# EAGLE schematic pathfiner (EAGLE 9.1.2)
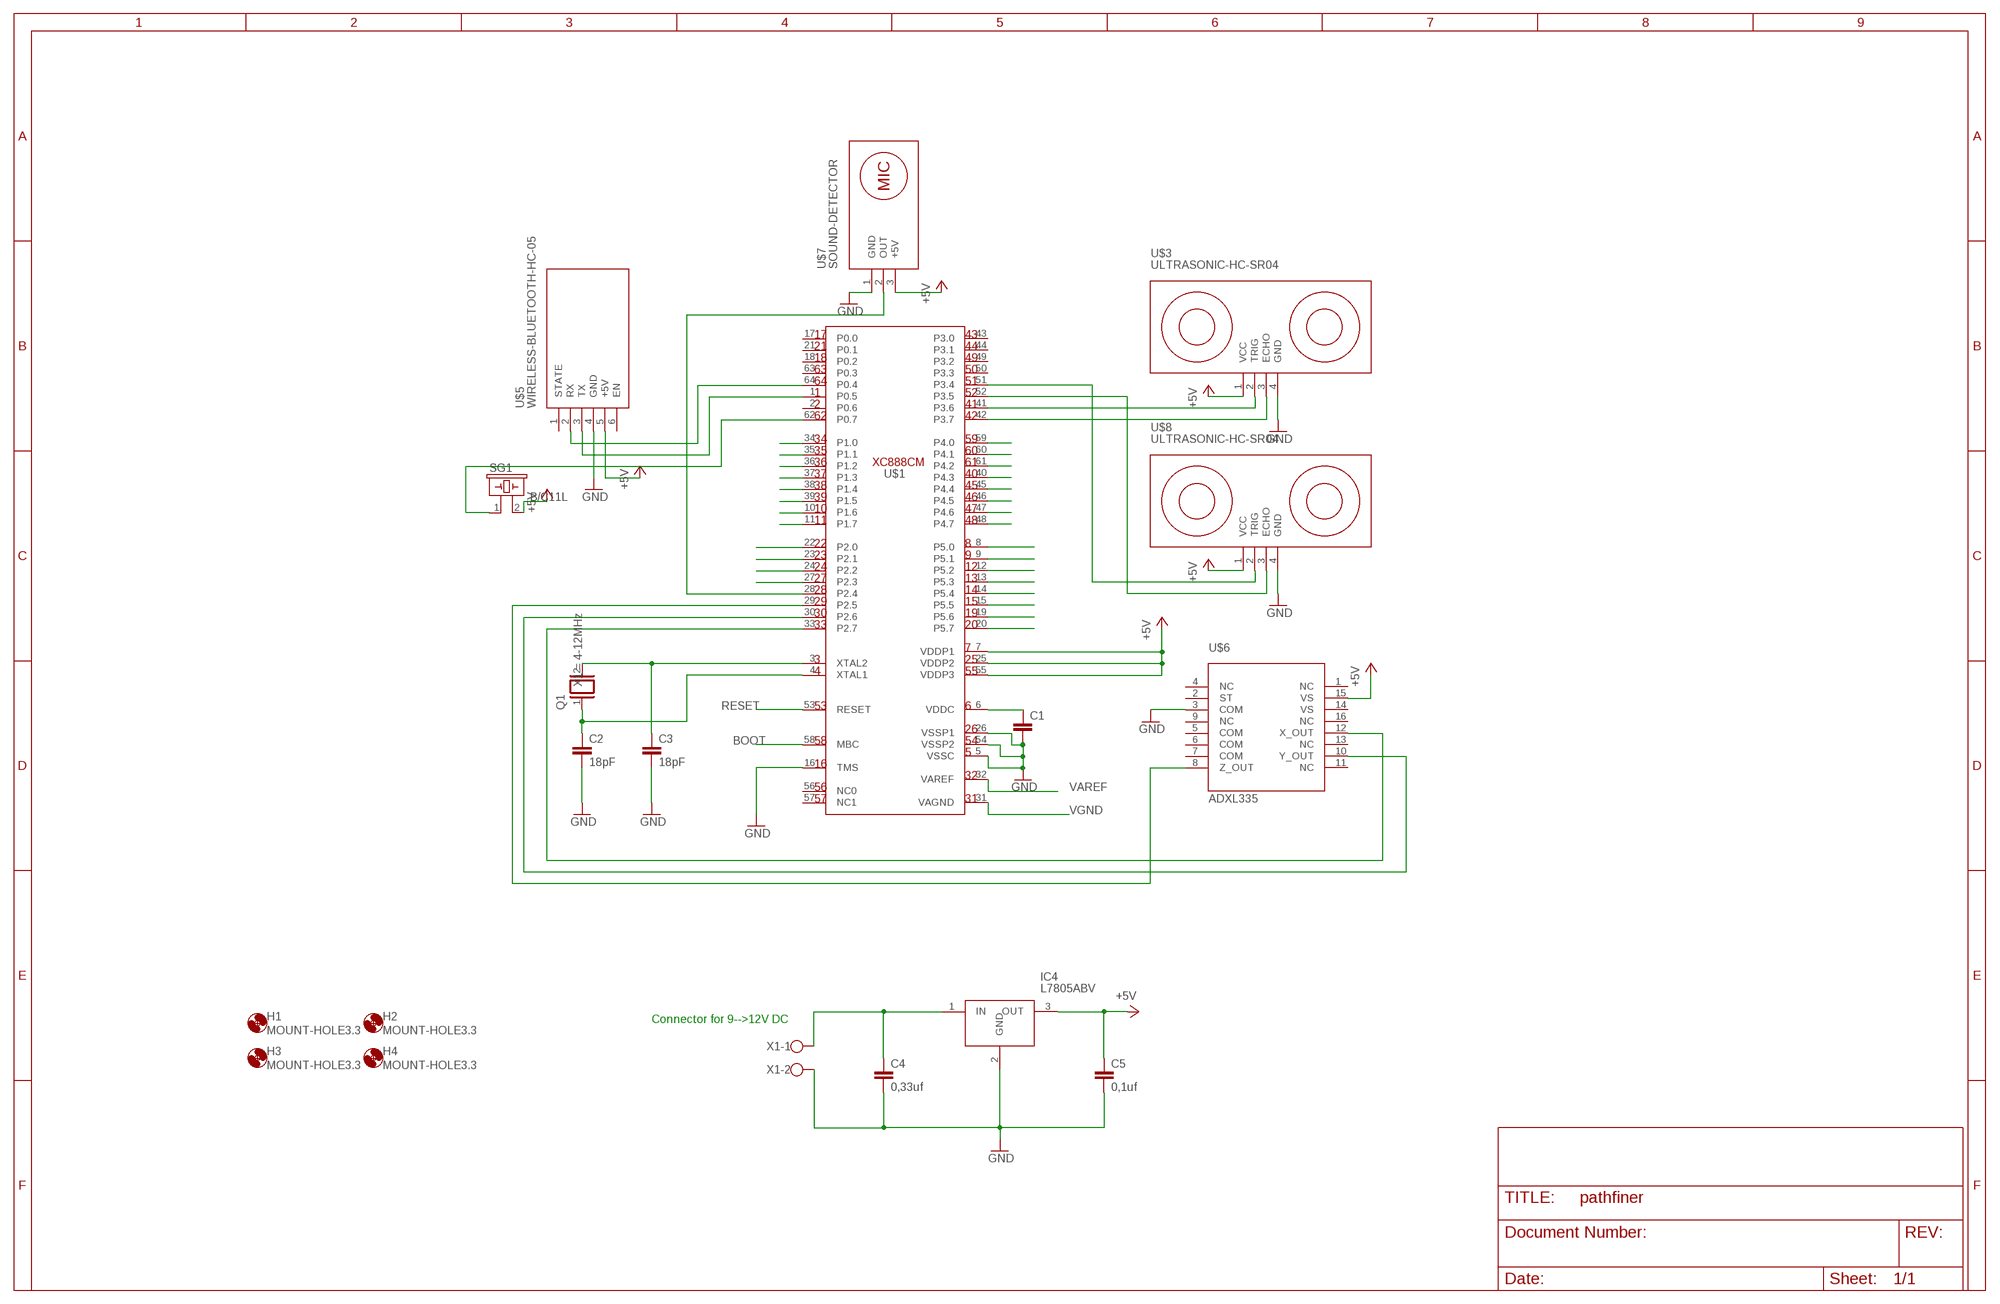
[diagram p0: schematic, sheet 1]

## Parts
C1  C2,5-3  [C2.5-3]
C2  18pF  C2,5-3  [C2.5-3]
C3  18pF  C2,5-3  [C2.5-3]
C4  0,33uf  C-EU025-030X050  [C025-030X050]
C5  0,1uf  C-EU025-030X050  [C025-030X050]
H1  MOUNT-HOLE3.3  [3,3]
H2  MOUNT-HOLE3.3  [3,3]
H3  MOUNT-HOLE3.3  [3,3]
H4  MOUNT-HOLE3.3  [3,3]
IC4  L7805ABV  [TO270P460X1020X2008-3P]
Q1  XTAL  [Q]
SG1  B/C11L  [B/C11L]
U$1  XC888  [QFP50P1200X1200X160-64N]
U$3  ULTRASONIC-HC-SR04  [ULTRASONIC-HC-SR04]
U$5  WIRELESS-BLUETOOTH-HC-05  [WIRELESS-BLUETOOTH-HC-05]
U$6  ADXL335  [LFCSP16]
U$7  SOUND-DETECTOR  [SOUND-DETECTOR]
U$8  ULTRASONIC-HC-SR04  [ULTRASONIC-HC-SR04]
X1  W237-102  [W237-102]

## Nets
+5V: C5.1 IC4.3(OUT) SG1.2 U$1.7(VDDP1) U$1.25(VDDP2) U$1.55(VDDP3) U$3.1(VCC) U$5.5(+5V) U$6.15(VS) U$7.3(+5V) U$8.1(VCC)
BOOT: U$1.58(MBC)
GND: C1.2 C2.2 C3.2 C4.2 C5.2 IC4.2(GND) U$1.5(VSSC) U$1.16(TMS) U$1.26(VSSP1) U$1.54(VSSP2) U$3.4(GND) U$5.4(GND) U$6.3(COM) U$7.1(GND) U$8.4(GND) X1.2
N$1: U$1.33(P2.7) U$6.12(X_OUT)
N$2: U$1.28(P2.4) U$7.2(OUT)
N$3: U$1.29(P2.5) U$6.8(Z_OUT)
N$4: C4.1 IC4.1(IN) X1.1
N$5: U$1.27(P2.3)
N$6: U$1.24(P2.2)
N$7: U$1.23(P2.1)
N$8: U$1.22(P2.0)
N$9: U$1.11(P1.7)
N$10: U$1.10(P1.6)
N$11: U$1.39(P1.5)
N$12: U$1.38(P1.4)
N$13: U$1.37(P1.3)
N$14: U$1.36(P1.2)
N$15: U$1.35(P1.1)
N$16: U$1.34(P1.0)
N$17: SG1.1 U$1.62(P0.7)
N$19: U$1.1(P0.5) U$5.3(TX)
N$20: U$1.64(P0.4) U$5.2(RX)
N$29: U$1.52(P3.5) U$8.3(ECHO)
N$31: U$1.41(P3.6) U$3.2(TRIG)
N$32: U$1.42(P3.7) U$3.3(ECHO)
N$33: U$1.59(P4.0)
N$34: U$1.60(P4.1)
N$35: U$1.61(P4.2)
N$36: U$1.40(P4.3)
N$37: U$1.45(P4.4)
N$38: U$1.46(P4.5)
N$39: U$1.47(P4.6)
N$40: U$1.48(P4.7)
N$41: U$1.8(P5.0)
N$42: U$1.9(P5.1)
N$43: U$1.12(P5.2)
N$44: U$1.13(P5.3)
N$45: U$1.14(P5.4)
N$46: U$1.15(P5.5)
N$47: U$1.19(P5.6)
N$48: U$1.20(P5.7)
N$49: C3.1 Q1.2 U$1.3(XTAL2)
N$50: C2.1 Q1.1 U$1.4(XTAL1)
N$52: C1.1 U$1.6(VDDC)
N$67: U$1.51(P3.4) U$8.2(TRIG)
N$68: U$1.30(P2.6) U$6.10(Y_OUT)
RESET: U$1.53(RESET)
VAREF: U$1.32(VAREF)
VGND: U$1.31(VAGND)
Unconnected: U$1.2(P0.6) U$1.17(P0.0) U$1.18(P0.2) U$1.21(P0.1) U$1.43(P3.0) U$1.44(P3.1) U$1.49(P3.2) U$1.50(P3.3) U$1.56(NC0) U$1.57(NC1) U$1.63(P0.3) U$5.1(STATE) U$5.6(EN) U$6.1(NC) U$6.2(ST) U$6.4(NC) U$6.5(COM) U$6.6(COM) U$6.7(COM) U$6.9(NC) U$6.11(NC) U$6.13(NC) U$6.14(VS) U$6.16(NC)

## Notes on the sheet
- Connector for 9-->12V DC

## Library data of the parts
C1-C3 = capacitor-wima:C: CAPACITOR naming: grid - package width
C4 C5 = rcl:C-EU: CAPACITOR, European symbol; SPICEPREFIX: C
H1-H4 = holes:MOUNT-HOLE: MOUNTING HOLE with drill center marker
IC4 = L7805ABV:L7805ABV: Voltage Regulator 5V 1A TO220 L7805ABV, Voltage Regulator, 1A 5 V, 2%, 3-Pin TO-220 Source: Datasheet <http://www.st.com/web/en/resource/technical/document/datasheet/CD00000444.pdf>; ALLIED_NUMBER: 70013890; ALLIED_PRICE-STOCK: http://www.alliedelec.com/stmicroelectronics-l7805abv/70013890/; DESCRIPTION: Voltage Regulator 5V 1A TO220 L7805ABV, Voltage Regulator, 1A 5 V, 2%, 3-Pin TO-220; HEIGHT: 4.6mm; MANUFACTURER_NAME: STMicroelectronics; MANUFACTURER_PART_NUMBER: L7805ABV; MOUSER_PART_NUMBER: 511-L7805ABV; MOUSER_PRICE-STOCK: https://www.mouser.com/Search/Refine.aspx?Keyword=511-L7805ABV; RS_PART_NUMBER: 6869820P; RS_PRICE-STOCK: http://uk.rs-online.com/web/p/products/6869820P
Q1 = special:XTAL: CRYSTAL; X1: 4-12MHz
SG1 = buzzer:B/C11L: BUZZER Source: Buerklin; OC_FARNELL: unknown; OC_NEWARK: unknown
U$1 = xc888:XC888
U$3 U$8 = ultrasonic:ULTRASONIC-HC-SR04: Ultrasonic Ranging Module HC-SR04 More details available here: http://randomnerdtutorials.com/complete-guide-for-ultrasonic-sensor-hc-sr04/ Click here to find device on ebay.com <http://www.ebay.com/sch/hc+sr04+ultrasonic>
U$5 = ultrasonic:WIRELESS-BLUETOOTH-HC-05: Bluetooth Transceiver Module based on HC-05 board Tutorial is available here: https://arduino-info.wikispaces.com/BlueTooth-HC05-HC06-Modules-How-To Click here to find device on ebay.com <http://www.ebay.com/sch/hc-05+module+rs232>
U$6 = adxl335:ADXL335: ADXL335 Package: LFCSP16 Descripton: small, low power, 3-Axis ±3g Accelerometer Author: Braekevelt Wim Student @ KHBO Ostend Mail : braekevelt.wim@telenet.be <mailto:braekevelt.wim@telenet.be?subject=ADXL335 remark>; IC: ADXL335
U$7 = diy-modules (1):SOUND-DETECTOR: Sound Detection Module
X1 = con-wago-500:W237-102: WAGO SCREW CLAMP